# Altium schematic sheet POWER.SchDoc: Science - 4_Power
size Letter; DrawnBy: Christopher Arjune; Organization: UW Robotics; Address1: 200 University Avenue; Address2: Waterloo; Address3: Ontario; Address4: Canada N2L 3G6; SheetNumber: 4; SheetTotal: 6
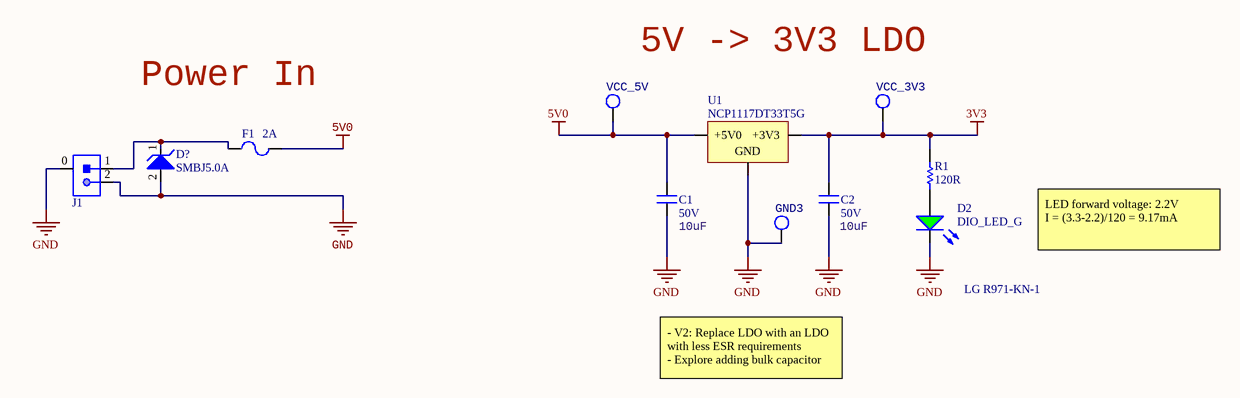
[diagram p0: POWER.SchDoc]

## Parts
C1  Voltage Rating: 50V  [CAPC1206(3216)]  (hidden comment: 10uF)
C2  Voltage Rating: 50V  [CAPC1206(3216)]  (hidden comment: 10uF)
D2  DIO_LED_G  MPN: LG R971-KN-1  [LED_0805_LINE]
D?  Manufacturer Part Number 1: SMBJ5.0A  [TVS_DIODE_BIDIRECTIONAL]  (hidden comment: TVS_DIODE_UNIDIR_5V)
F1  Current Rating: 2A  [FUSE_0603]  (hidden comment: FUSE_2A_0603)
GND3  TESTPOINT_LOOP  [TESTPOINT_LOOP]  (value not drawn)
J1  CON_2M_SM_RA  [MOLEX-5024940270]  (value not drawn)
R1  value 120R  [RESC0603(1608)_N]  (hidden comment: RES_120R_0603)
U1  MPN: NCP1117DT33T5G  [VOLTAGE_REGULATOR]  (hidden comment: 5V0_3V3_LDO)
VCC_3V3  TESTPOINT_LOOP  [TESTPOINT_LOOP]  (value not drawn)
VCC_5V  TESTPOINT_LOOP  [TESTPOINT_LOOP]  (value not drawn)

## Nets
3V3: C2.1 R1.2 U1.2(+3V3) VCC_3V3.1
5V0: C1.1 F1.2 U1.3(+5V0) VCC_5V.1
GND: C1.2 C2.2 D2.2(K) D?.2 GND3.1 J1.0 J1.2 U1.1(GND)
NetD2_1: D2.1(A) R1.1
NetD?_1: D?.1 F1.1 J1.1

## Notes on the sheet
- Power In
- 5V -> 3V3 LDO
- LED forward voltage: 2.2V
  I = (3.3-2.2)/120 = 9.17mA
- - V2: Replace LDO with an LDO with less ESR requirements
  - Explore adding bulk capacitor
- Title
- Size:
- Date:
- Letter
- Drawn By:
- Sheet
- of
- File:

## Library data of the parts
C1 C2 = CAP_10uF_50V_1206: CAP CER 10UF 50V X5R 1206; MPN: GRT31CR61H106KE01L; Manufacturer: Murata; Dimensions: 0.126" L x 0.063" W (3.20mm x 1.6mm); Package: 1206 (3216 Metric); Value: 10uF; Supplier Part Number 1: 490-12456-1-ND; Supplier 1: Digi-Key
D2 = DIO_LED_G: LED GREEN DIFFUSED 0805 SMD; Manufacturer: OSRAM; Forward Voltage Drop: 2.2V; Package: 0805 (2012 Metric); Supplier Part Number 1: 475-1410-1-ND; Supplier 1: Digi-Key
D? = TVS_DIODE_UNIDIR_5V: TVS DIODE 5V 9.2V DO214AA; Manufacturer 1: Littelfuse; Max Power Dissipation: 600W; Polarity: Unidirectional; Number of Elements: 1; Leakage Current: 800uA; Reverse Breakdown Voltage: 6.4V; Max Surge Current: 65.3A; Max Breakdown Voltage: 7V; Test Current: 10mA; Element Configuration: Single; Power Line Protection: No; Current: 68A; ESD Protection: Yes; ComponentLink1Description: Datasheet; ComponentLink1URL: https://www.littelfuse.com/~/media/electronics/datasheets/tvs_diodes/littelfuse_tvs_diode_smbj_datasheet.pdf.pdf; Supplier 1: Digi-Key; Stock 1: 14825; Pricing 1: 1=0.41000, 10=0.30500, 25=0.27520, 100=0.14500, 250=0.14352, 500=0.12850, 1000=0.10000 (USD); RoHS: Yes; Mount: Surface Mount; Case/Package: SMB; Number of Pins: 2; Min Operating Temperature: -55°C; Max Operating Temperature: 150°C; Packaging: Tape and Reel; Package Quantity: 3000; Power Dissipation: 600W; Direction: Unidirectional; Reverse Standoff Voltage: 5V; Min Breakdown Voltage: 6.4V; Clamping Voltage: 9.2V; Peak Pulse Power: 600W; Breakdown Voltage: 6.4V; Termination: SMD/SMT; Peak Pulse Current: 65.3A; Number of Channels: 1; Max Reverse Leakage Current: 800uA; Operating Supply Voltage: 5V; Number of Unidirectional Channels: 1; Composition: Zener; Voltage Rating (DC): 5V; Voltage: 5V; Length: 0.179inch; Height: 0.096inch; Width: 0.155inch; Radiation Hardening: No; REACH SVHC: Unknown; Lead Free: Lead Free; ComponentLink2URL: https://datasheet.ciiva.com/25624/0900766b810f4eeb-25624712.pdf?src-supplier=RSComponents; ComponentLink2Description: https://datasheet.ciiva.com/25624/0900766b810f4eeb-25624712.pdf?src-supplier=RSComponents; ComponentLink3URL: https://datasheet.ciiva.com/34302/1546929-34302459.pdf?src-supplier=Jameco; ComponentLink3Description: https://datasheet.ciiva.com/34302/1546929-34302459.pdf?src-supplier=Jameco; ComponentLink4URL: https://datasheet.ciiva.com/46381/1677318-46381958.pdf?src-supplier=Element14; ComponentLink4Description: https://datasheet.ciiva.com/46381/1677318-46381958.pdf?src-supplier=Element14; ComponentLink5URL: https://datasheet.ciiva.com/331/littelfuse-tvs-diode-smbj-datasheet-pdf-331131.pdf?src-supplier=Digi-Key; ComponentLink5Description: https://datasheet.ciiva.com/331/littelfuse-tvs-diode-smbj-datasheet-pdf-331131.pdf?src-supplier=Digi-Key; ComponentLink6URL: https://datasheet.ciiva.com/331/littelfuse-tvs-diode-smbj-datasheet-pdf-331132.pdf?src-supplier=Digi-Key; ComponentLink6Description: https://datasheet.ciiva.com/331/littelfuse-tvs-diode-smbj-datasheet-pdf-331132.pdf?src-supplier=Digi-Key; ComponentLink7URL: https://datasheet.ciiva.com/331/littelfuse-tvs-diode-smbj-datasheet-pdf-331133.pdf?src-supplier=Digi-Key; ComponentLink7Description: https://datasheet.ciiva.com/331/littelfuse-tvs-diode-smbj-datasheet-pdf-331133.pdf?src-supplier=Digi-Key; Supplier Part Number 1: SMBJ5.0ALFCT-ND
F1 = FUSE_2A_0603: FUSE SMD 2A 32V; ComponentLink1URL: https://datasheet.ciiva.com/303/467-303400.pdf?src-supplier=Digi-Key; ComponentLink1Description: https://datasheet.ciiva.com/303/467-303400.pdf?src-supplier=Digi-Key; ComponentLink2URL: http://datasheet.octopart.com/0467002.NRHF-Littelfuse-datasheet-32023482.pdf?src-supplier=Future+Electronics; ComponentLink2Description: http://datasheet.octopart.com/0467002.NRHF-Littelfuse-datasheet-32023482.pdf?src-supplier=Future+Electronics; ComponentLink3URL: http://datasheet.octopart.com/0467002.NRHF-Littelfuse-datasheet-136509808.pdf?src-supplier=Future+Electronics; ComponentLink3Description: http://datasheet.octopart.com/0467002.NRHF-Littelfuse-datasheet-136509808.pdf?src-supplier=Future+Electronics; Mount: Surface Mount; Voltage Rating (AC): 32V; Voltage Rating (DC): 32V; Supplier 1: Digi-Key; Supplier Part Number 1: F7132CT-ND; Supplier Packaging 1: Cut Tape
GND3 VCC_3V3 VCC_5V = TESTPOINT_LOOP: Loop testpoint through-hole pad; Manufacturer: Keystone Electronics; Manufacturer Part Number 1: 5002; Supplier Part Number 1: 36-5002-ND; Supplier 1: Digi-Key
J1 = CON_2M_SM_RA: CONN HEADER SMD RIGHT ANGLE 2MM PITCH; Manufacturer 1: Molex; Manufacturer Part Number 1: 5024940270; Connector Type: Receptacle,Forked; Number of Positions: 2; Supplier 1: Digi-Key; Supplier Part Number 1: WM15810CT-ND; ComponentLink1URL: https://www.molex.com/pdm_docs/as/AS-502439-002-001.pdf?src-supplier=Digi-Key; ComponentLink1Description: https://www.molex.com/pdm_docs/as/AS-502439-002-001.pdf?src-supplier=Digi-Key; Stock 1: 3397; Pricing 1: 1=0.53000, 10=0.49400, 25=0.44440, 50=0.39500, 100=0.37850, 250=0.34556 (USD); RoHS: No; Mount: Surface Mount; Contact Plating: Tin; Insulation Color: Natural; Insulation Material: Resin; Min Operating Temperature: -40°C; Max Operating Temperature: 105°C; Fastening Type: Latch; Packaging: Tape and Reel; Number of Rows: 1; Termination: Solder; Flammability Rating: UL94 V-0
R1 = RES_120R_0603: RES SMD 120 OHM 5% 1/10W 0603; Manufacturer: Yageo; MPN: RC0603JR-07120RL; Dimensions: 0.063" L x 0.031" W (1.60mm x 0.80mm); Tolerance: 5%; Package: 0603 (1608 Metric); Supplier Part Number 1: 311-120GRCT-ND; Supplier 1: Digi-Key
U1 = 5V0_3V3_LDO: IC REG LINEAR 3.3V 1A DPAK; Manufacturer: ON Semiconductor; Current Output: 1A; Supplier Part Number 1: NCP1117DT33T5GOSCT-ND; Supplier 1: Digi-Key